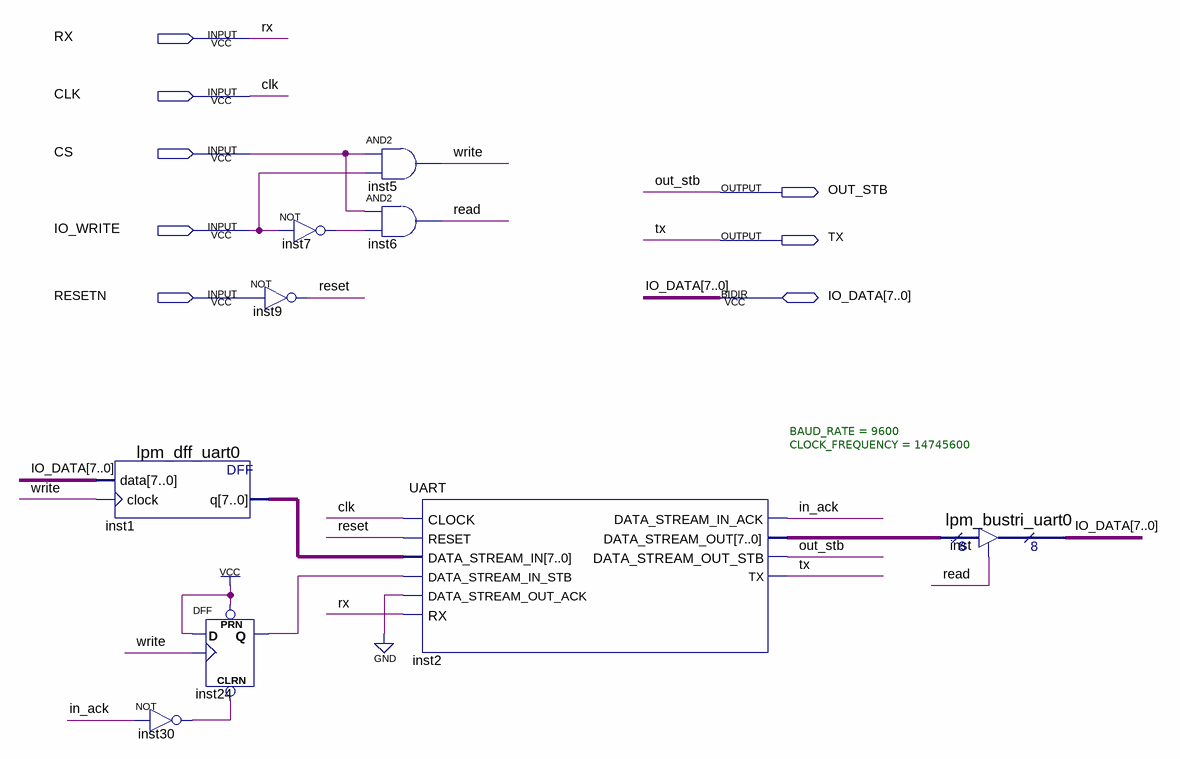
[diagram p0: schematic sheet]
// Quartus schematic UART_INTERFACE.bdf as structural Verilog: 9 symbols, 8 pins
module UART_INTERFACE (
  input  RX,
  input  CLK,
  input  CS,
  input  IO_WRITE,
  input  RESETN,
  inout  [7:0] IO_DATA,
  output OUT_STB,
  output TX
);

  wire in_ack, inst7_out, inst24_q, inst30_out, read, reset, write;
  wire [7:0] inst1_q, inst2_data_stream_out;

  lpm_dff_uart0 inst1 (.data(IO_DATA), .clock(write), .q(inst1_q));
  not inst30 (inst30_out, in_ack);
  DFF inst24 (.CLRN(inst30_out), .CLK(write), .D(1'b1), .PRN(1'b1), .Q(inst24_q));
  not inst7 (inst7_out, IO_WRITE);
  not inst9 (reset, RESETN);
  and inst5 (write, CS, IO_WRITE);
  and inst6 (read, CS, inst7_out);
  UART #(.BAUD_RATE(9600), .CLOCK_FREQUENCY(14745600)) inst2 (
    .CLOCK(CLK), .RESET(reset), .DATA_STREAM_IN(inst1_q), .DATA_STREAM_IN_STB(inst24_q),
    .DATA_STREAM_OUT_ACK(1'b0), .RX(RX), .DATA_STREAM_IN_ACK(in_ack),
    .DATA_STREAM_OUT(inst2_data_stream_out), .DATA_STREAM_OUT_STB(OUT_STB), .TX(TX));
  lpm_bustri_uart0 inst (.enabledt(read), .data(inst2_data_stream_out), .tridata(IO_DATA));
endmodule
